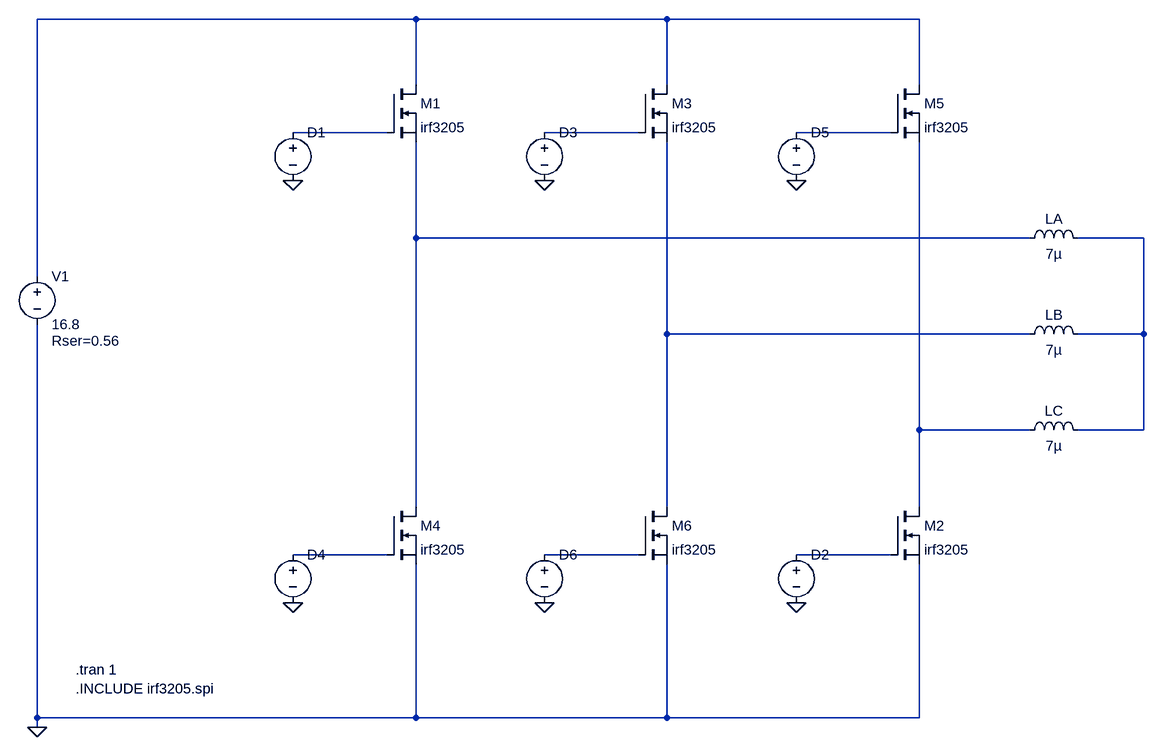
[diagram p0: schematic ESC.asc]
ESC.asc, the LTspice schematic file:
Version 4
SHEET 1 2984 1012
WIRE 512 -320 -576 -320
WIRE 1376 -320 512 -320
WIRE 2240 -320 1376 -320
WIRE 512 -96 512 -320
WIRE 1376 -96 1376 -320
WIRE 2240 -96 2240 -320
WIRE 464 -16 -48 -16
WIRE 1328 -16 960 -16
WIRE 2192 -16 1840 -16
WIRE 512 160 512 0
WIRE 2576 160 512 160
WIRE 2976 160 2656 160
WIRE -576 224 -576 -320
WIRE 1376 320 1376 0
WIRE 2576 320 1376 320
WIRE 2976 320 2976 160
WIRE 2976 320 2656 320
WIRE 2240 480 2240 0
WIRE 2576 480 2240 480
WIRE 2976 480 2976 320
WIRE 2976 480 2656 480
WIRE 512 608 512 160
WIRE 1376 608 1376 320
WIRE 2240 608 2240 480
WIRE 464 688 -48 688
WIRE 1328 688 960 688
WIRE 2192 688 1840 688
WIRE -576 960 -576 304
WIRE 512 960 512 704
WIRE 512 960 -576 960
WIRE 1376 960 1376 704
WIRE 1376 960 512 960
WIRE 2240 960 2240 704
WIRE 2240 960 1376 960
WIRE -576 976 -576 960
FLAG -48 64 0
FLAG -48 768 0
FLAG 960 64 0
FLAG 960 768 0
FLAG 1840 768 0
FLAG 1840 64 0
FLAG -576 976 0
SYMBOL voltage -576 208 R0
WINDOW 123 0 0 Left 0
WINDOW 39 24 124 Left 2
SYMATTR SpiceLine Rser=0.56
SYMATTR InstName V1
SYMATTR Value 16.8
SYMBOL voltage -48 -32 R0
WINDOW 3 24 96 Invisible 2
WINDOW 123 0 0 Left 0
WINDOW 39 24 44 Left 2
SYMATTR Value PULSE(0 20 500m 0 0 200m 600m)
SYMATTR InstName D1
SYMBOL nmos 2192 608 R0
SYMATTR InstName M2
SYMATTR Value irf3205
SYMATTR Prefix X
SYMBOL nmos 464 -96 R0
SYMATTR InstName M1
SYMATTR Value irf3205
SYMATTR Prefix X
SYMBOL nmos 1328 -96 R0
SYMATTR InstName M3
SYMATTR Value irf3205
SYMATTR Prefix X
SYMBOL nmos 2192 -96 R0
SYMATTR InstName M5
SYMATTR Value irf3205
SYMATTR Prefix X
SYMBOL nmos 1328 608 R0
SYMATTR InstName M6
SYMATTR Value irf3205
SYMATTR Prefix X
SYMBOL nmos 464 608 R0
SYMATTR InstName M4
SYMATTR Value irf3205
SYMATTR Prefix X
SYMBOL voltage 1840 672 R0
WINDOW 3 24 96 Invisible 2
WINDOW 123 0 0 Left 0
WINDOW 39 24 44 Left 2
SYMATTR Value PULSE(0 20 0 0 0 200m 600m)
SYMATTR InstName D2
SYMBOL voltage 960 -32 R0
WINDOW 3 24 96 Invisible 2
WINDOW 123 0 0 Left 0
WINDOW 39 24 44 Left 2
SYMATTR Value PULSE(0 20 100m 0 0 200m 600m)
SYMATTR InstName D3
SYMBOL voltage -48 672 R0
WINDOW 3 24 96 Invisible 2
WINDOW 123 0 0 Left 0
WINDOW 39 24 44 Left 2
SYMATTR Value PULSE(0 20 200m 0 0 200m 600m)
SYMATTR InstName D4
SYMBOL voltage 1840 -32 R0
WINDOW 3 24 96 Invisible 2
WINDOW 123 0 0 Left 0
WINDOW 39 24 44 Left 2
SYMATTR Value PULSE(0 20 300m 0 0 200m 600m)
SYMATTR InstName D5
SYMBOL voltage 960 672 R0
WINDOW 3 24 96 Invisible 2
WINDOW 123 0 0 Left 0
WINDOW 39 24 44 Left 2
SYMATTR Value PULSE(0 20 400m 0 0 200m 600m)
SYMATTR InstName D6
SYMBOL ind 2560 336 R270
WINDOW 0 32 56 VTop 2
WINDOW 3 5 56 VBottom 2
SYMATTR InstName LB
SYMATTR Value 7µ
SYMATTR SpiceLine Rser=30m
SYMBOL ind 2560 176 R270
WINDOW 0 32 56 VTop 2
WINDOW 3 5 56 VBottom 2
SYMATTR InstName LA
SYMATTR Value 7µ
SYMATTR SpiceLine Rser=30m
SYMBOL ind 2560 496 R270
WINDOW 0 32 56 VTop 2
WINDOW 3 5 56 VBottom 2
SYMATTR InstName LC
SYMATTR Value 7µ
SYMATTR SpiceLine Rser=30m
TEXT -512 880 Left 2 !.tran 1
TEXT -512 912 Left 2 !.INCLUDE irf3205.spi

The netlist it stands for:
* ESC.asc
V1 N001 0 16.8 Rser=0.56
V§D1 N002 0 PULSE(0 20 500m 0 0 200m 600m)
XM2 N008 N011 0 irf3205  ; pins D G S
XM1 N001 N002 N005 irf3205  ; pins D G S
XM3 N001 N003 N007 irf3205  ; pins D G S
XM5 N001 N004 N008 irf3205  ; pins D G S
XM6 N007 N010 0 irf3205  ; pins D G S
XM4 N005 N009 0 irf3205  ; pins D G S
V§D2 N011 0 PULSE(0 20 0 0 0 200m 600m)
V§D3 N003 0 PULSE(0 20 100m 0 0 200m 600m)
V§D4 N009 0 PULSE(0 20 200m 0 0 200m 600m)
V§D5 N004 0 PULSE(0 20 300m 0 0 200m 600m)
V§D6 N010 0 PULSE(0 20 400m 0 0 200m 600m)
LB N007 N006 7µ Rser=30m
LA N005 N006 7µ Rser=30m
LC N008 N006 7µ Rser=30m
.tran 1
.INCLUDE irf3205.spi
.backanno
.end